# Altium schematic sheet Placa_da_Base.SchDoc: Placa Motores e Sensores
size A3; Author: Eng. Davi Alexandre; CompanyName: Lamotriz; Organization: UFC; Address1: Fortaleza, Ceará - Brasil; Revision: Prof. Dr. Wilckley Bezerra; SheetNumber: 2; SheetTotal: 2; Machine: Lightweight Robot Arm; VersionProject: 2
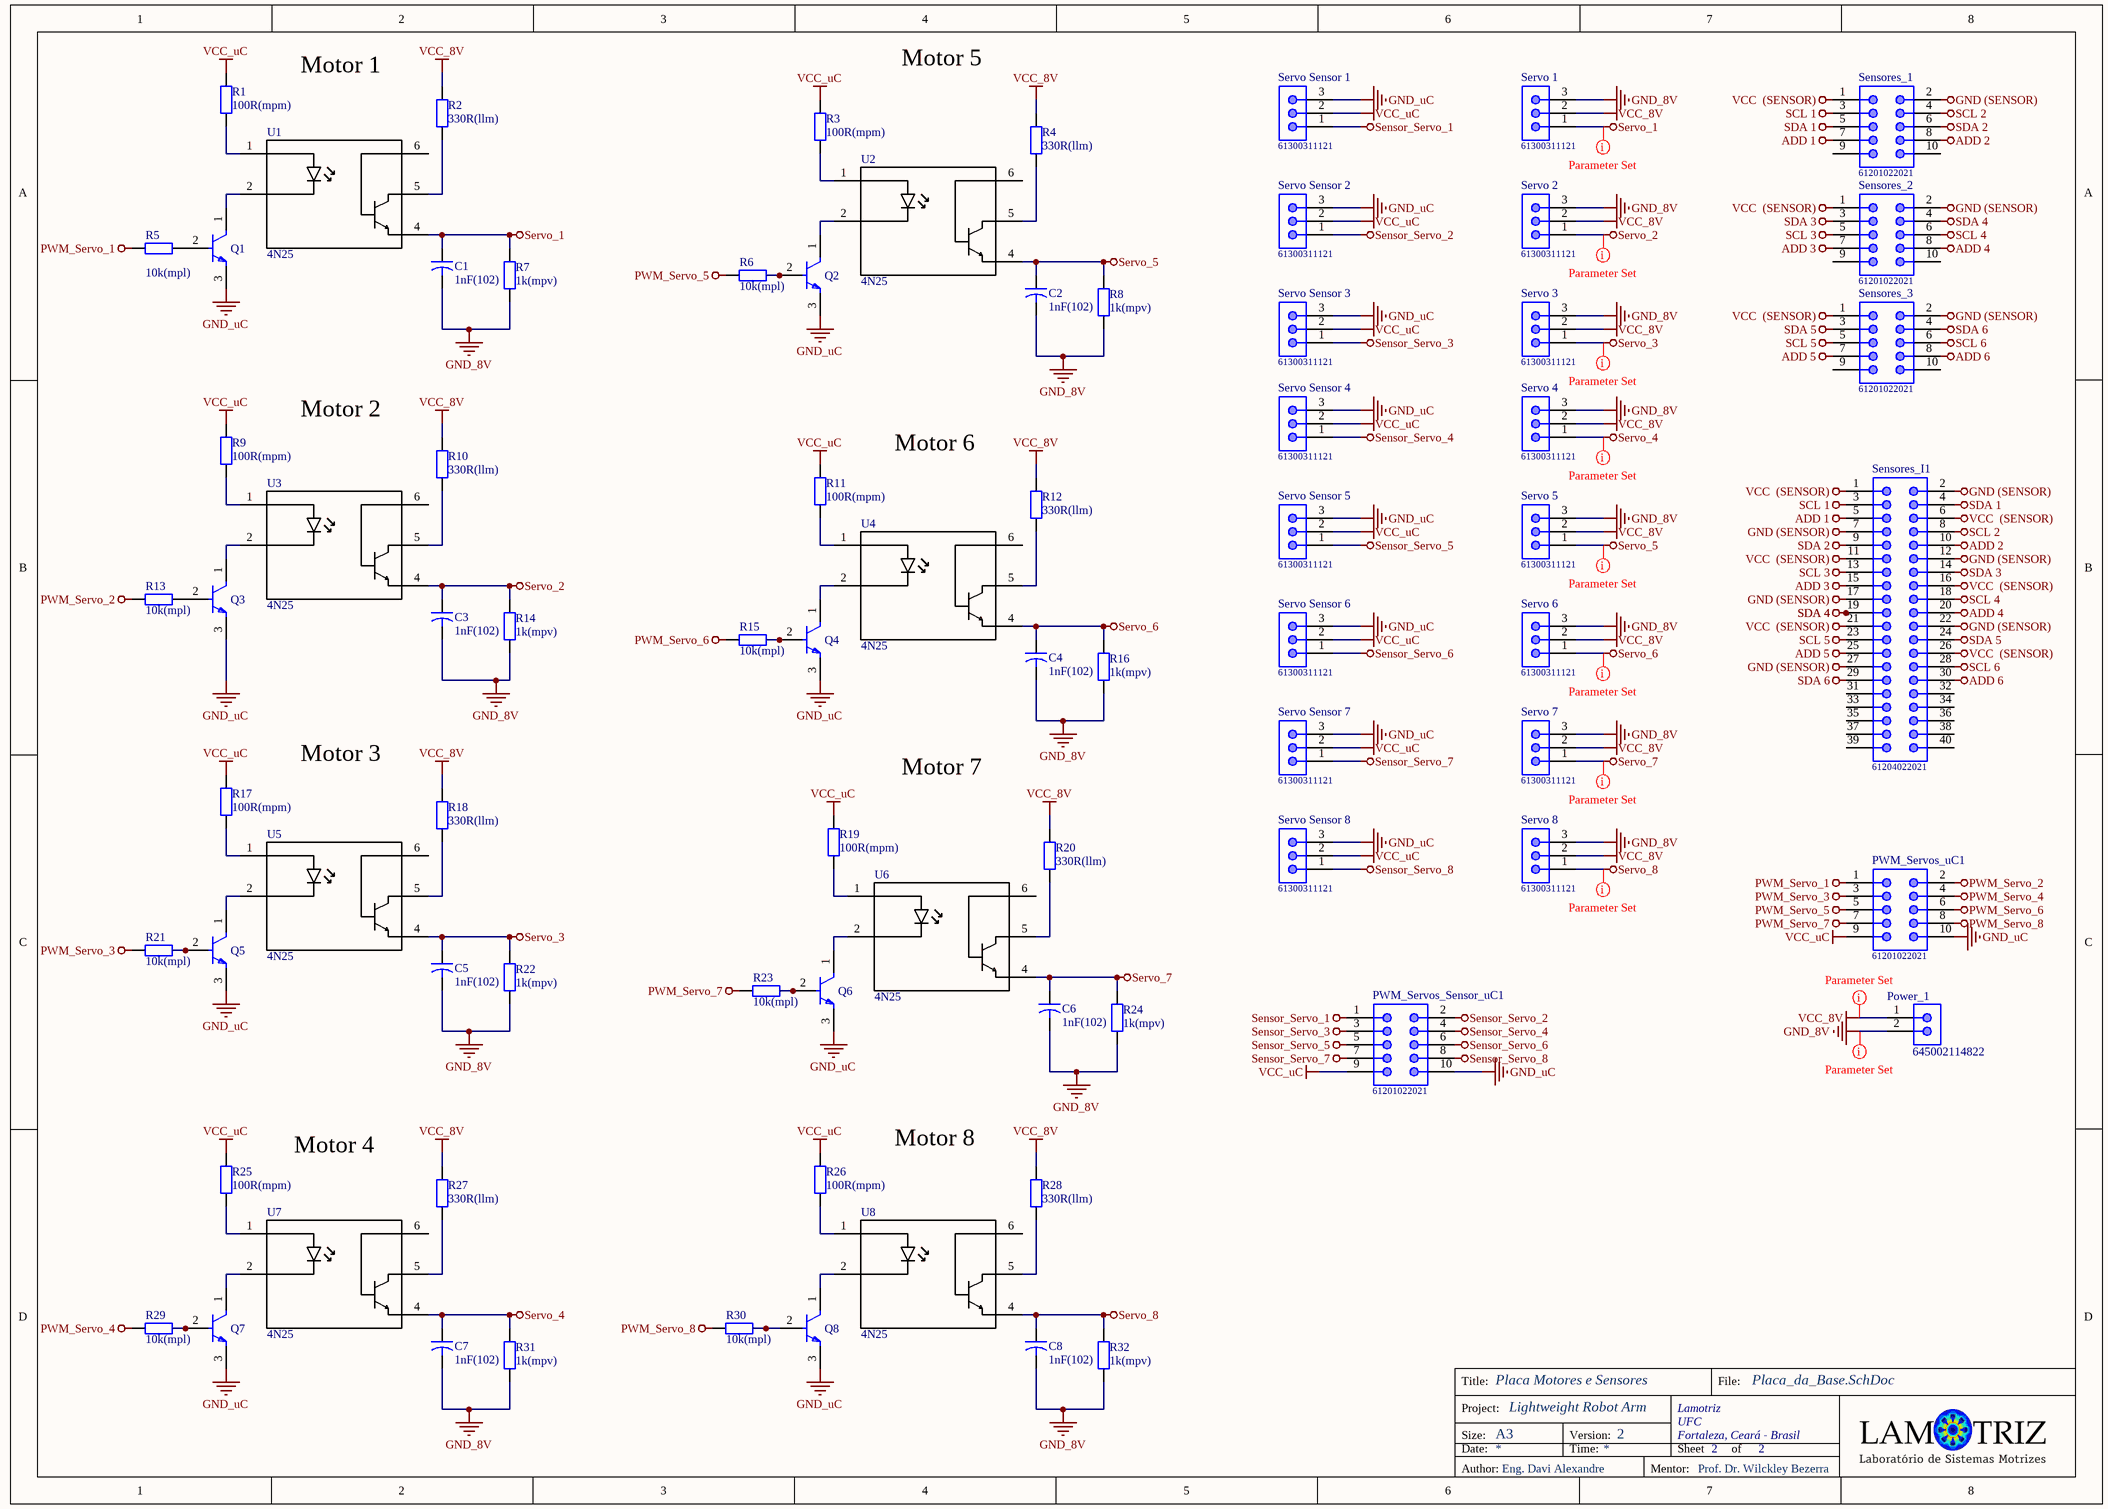
[diagram p0: Placa_da_Base.SchDoc]

## Parts
C1  1nF(102)  [CAPR5-4X5]
C2  1nF(102)  [CAPR5-4X5]
C3  1nF(102)  [CAPR5-4X5]
C4  1nF(102)  [CAPR5-4X5]
C5  1nF(102)  [CAPR5-4X5]
C6  1nF(102)  [CAPR5-4X5]
C7  1nF(102)  [CAPR5-4X5]
C8  1nF(102)  [CAPR5-4X5]
Power_1  645002114822  [645002114822]
PWM_Servos_Sensor_uC1  61201022021  [61201022021]
PWM_Servos_uC1  61201022021  [61201022021]
Q1  Trans_Fairchild_BC547_eec  [Fairchild_BC547_0]  (value not drawn)
Q2  Trans_Fairchild_BC547_eec  [Fairchild_BC547_0]  (value not drawn)
Q3  Trans_Fairchild_BC547_eec  [Fairchild_BC547_0]  (value not drawn)
Q4  Trans_Fairchild_BC547_eec  [Fairchild_BC547_0]  (value not drawn)
Q5  Trans_Fairchild_BC547_eec  [Fairchild_BC547_0]  (value not drawn)
Q6  Trans_Fairchild_BC547_eec  [Fairchild_BC547_0]  (value not drawn)
Q7  Trans_Fairchild_BC547_eec  [Fairchild_BC547_0]  (value not drawn)
Q8  Trans_Fairchild_BC547_eec  [Fairchild_BC547_0]  (value not drawn)
R1  100R(mpm)  [AXIAL-0.4]
R2  330R(llm)  [AXIAL-0.4]
R3  100R(mpm)  [AXIAL-0.4]
R4  330R(llm)  [AXIAL-0.4]
R5  10k(mpl)  [AXIAL-0.4]
R6  10k(mpl)  [AXIAL-0.4]
R7  1k(mpv)  [AXIAL-0.4]
R8  1k(mpv)  [AXIAL-0.4]
R9  100R(mpm)  [AXIAL-0.4]
R10  330R(llm)  [AXIAL-0.4]
R11  100R(mpm)  [AXIAL-0.4]
R12  330R(llm)  [AXIAL-0.4]
R13  10k(mpl)  [AXIAL-0.4]
R14  1k(mpv)  [AXIAL-0.4]
R15  10k(mpl)  [AXIAL-0.4]
R16  1k(mpv)  [AXIAL-0.4]
R17  100R(mpm)  [AXIAL-0.4]
R18  330R(llm)  [AXIAL-0.4]
R19  100R(mpm)  [AXIAL-0.4]
R20  330R(llm)  [AXIAL-0.4]
R21  10k(mpl)  [AXIAL-0.4]
R22  1k(mpv)  [AXIAL-0.4]
R23  10k(mpl)  [AXIAL-0.4]
R24  1k(mpv)  [AXIAL-0.4]
R25  100R(mpm)  [AXIAL-0.4]
R26  100R(mpm)  [AXIAL-0.4]
R27  330R(llm)  [AXIAL-0.4]
R28  330R(llm)  [AXIAL-0.4]
R29  10k(mpl)  [AXIAL-0.4]
R30  10k(mpl)  [AXIAL-0.4]
R31  1k(mpv)  [AXIAL-0.4]
R32  1k(mpv)  [AXIAL-0.4]
Sensores_1  61201022021  [61201022021]
Sensores_2  61201022021  [61201022021]
Sensores_3  61201022021  [61201022021]
Sensores_I1  61204022021  [61204022021]
Servo_1  61300311121  [61300311121]
Servo_2  61300311121  [61300311121]
Servo_3  61300311121  [61300311121]
Servo_4  61300311121  [61300311121]
Servo_5  61300311121  [61300311121]
Servo_6  61300311121  [61300311121]
Servo_7  61300311121  [61300311121]
Servo_8  61300311121  [61300311121]
Servo_Sensor_1  61300311121  [61300311121]
Servo_Sensor_2  61300311121  [61300311121]
Servo_Sensor_3  61300311121  [61300311121]
Servo_Sensor_4  61300311121  [61300311121]
Servo_Sensor_5  61300311121  [61300311121]
Servo_Sensor_6  61300311121  [61300311121]
Servo_Sensor_7  61300311121  [61300311121]
Servo_Sensor_8  61300311121  [61300311121]
U1  4N25  [*DIP762W50P254L712H400Q6N]
U2  4N25  [*DIP762W50P254L712H400Q6N]
U3  4N25  [*DIP762W50P254L712H400Q6N]
U4  4N25  [*DIP762W50P254L712H400Q6N]
U5  4N25  [*DIP762W50P254L712H400Q6N]
U6  4N25  [*DIP762W50P254L712H400Q6N]
U7  4N25  [*DIP762W50P254L712H400Q6N]
U8  4N25  [*DIP762W50P254L712H400Q6N]

## Nets
ADD 1: Sensores_1.7 Sensores_I1.5
ADD 2: Sensores_1.8 Sensores_I1.10
ADD 3: Sensores_2.7 Sensores_I1.15
ADD 4: Sensores_2.8 Sensores_I1.20
ADD 5: Sensores_3.7 Sensores_I1.25
ADD 6: Sensores_3.8 Sensores_I1.30
GND (SENSOR): Sensores_1.2 Sensores_2.2 Sensores_3.2 Sensores_I1.2 Sensores_I1.7 Sensores_I1.12 Sensores_I1.17 Sensores_I1.22 Sensores_I1.27
GND_8V: C1.2 C2.2 C3.2 C4.2 C5.2 C6.2 C7.2 C8.2 Power_1.2 R7.1 R8.1 R14.1 R16.1 R22.1 R24.1 R31.1 R32.1 Servo_1.3 Servo_2.3 Servo_3.3 Servo_4.3 Servo_5.3 Servo_6.3 Servo_7.3 Servo_8.3
GND_uC: PWM_Servos_Sensor_uC1.10 PWM_Servos_uC1.10 Q1.3(E) Q2.3(E) Q3.3(E) Q4.3(E) Q5.3(E) Q6.3(E) Q7.3(E) Q8.3(E) Servo_Sensor_1.3 Servo_Sensor_2.3 Servo_Sensor_3.3 Servo_Sensor_4.3 Servo_Sensor_5.3 Servo_Sensor_6.3 Servo_Sensor_7.3 Servo_Sensor_8.3
PWM_Servo_1: PWM_Servos_uC1.1 R5.2
PWM_Servo_2: PWM_Servos_uC1.2 R13.2
PWM_Servo_3: PWM_Servos_uC1.3 R21.2
PWM_Servo_4: PWM_Servos_uC1.4 R29.2
PWM_Servo_5: PWM_Servos_uC1.5 R6.2
PWM_Servo_6: PWM_Servos_uC1.6 R15.2
PWM_Servo_7: PWM_Servos_uC1.7 R23.2
PWM_Servo_8: PWM_Servos_uC1.8 R30.2
SCL 1: Sensores_1.3 Sensores_I1.3
SCL 2: Sensores_1.4 Sensores_I1.8
SCL 3: Sensores_2.5 Sensores_I1.13
SCL 4: Sensores_2.6 Sensores_I1.18
SCL 5: Sensores_3.5 Sensores_I1.23
SCL 6: Sensores_3.6 Sensores_I1.28
SDA 1: Sensores_1.5 Sensores_I1.4
SDA 2: Sensores_1.6 Sensores_I1.9
SDA 3: Sensores_2.3 Sensores_I1.14
SDA 4: Sensores_2.4 Sensores_I1.19
SDA 5: Sensores_3.3 Sensores_I1.24
SDA 6: Sensores_3.4 Sensores_I1.29
Sensor_Servo_1: PWM_Servos_Sensor_uC1.1 Servo_Sensor_1.1
Sensor_Servo_2: PWM_Servos_Sensor_uC1.2 Servo_Sensor_2.1
Sensor_Servo_3: PWM_Servos_Sensor_uC1.3 Servo_Sensor_3.1
Sensor_Servo_4: PWM_Servos_Sensor_uC1.4 Servo_Sensor_4.1
Sensor_Servo_5: PWM_Servos_Sensor_uC1.5 Servo_Sensor_5.1
Sensor_Servo_6: PWM_Servos_Sensor_uC1.6 Servo_Sensor_6.1
Sensor_Servo_7: PWM_Servos_Sensor_uC1.7 Servo_Sensor_7.1
Sensor_Servo_8: PWM_Servos_Sensor_uC1.8 Servo_Sensor_8.1
Servo_1: C1.1 R7.2 Servo_1.1 U1.4(E)
Servo_2: C3.1 R14.2 Servo_2.1 U3.4(E)
Servo_3: C5.1 R22.2 Servo_3.1 U5.4(E)
Servo_4: C7.1 R31.2 Servo_4.1 U7.4(E)
Servo_5: C2.1 R8.2 Servo_5.1 U2.4(E)
Servo_6: C4.1 R16.2 Servo_6.1 U4.4(E)
Servo_7: C6.1 R24.2 Servo_7.1 U6.4(E)
Servo_8: C8.1 R32.2 Servo_8.1 U8.4(E)
VCC  (SENSOR): Sensores_1.1 Sensores_2.1 Sensores_3.1 Sensores_I1.1 Sensores_I1.6 Sensores_I1.11 Sensores_I1.16 Sensores_I1.21 Sensores_I1.26
VCC_8V: Power_1.1 R2.2 R4.2 R10.2 R12.2 R18.2 R20.2 R27.2 R28.2 Servo_1.2 Servo_2.2 Servo_3.2 Servo_4.2 Servo_5.2 Servo_6.2 Servo_7.2 Servo_8.2
VCC_uC: PWM_Servos_Sensor_uC1.9 PWM_Servos_uC1.9 R1.2 R3.2 R9.2 R11.2 R17.2 R19.2 R25.2 R26.2 Servo_Sensor_1.2 Servo_Sensor_2.2 Servo_Sensor_3.2 Servo_Sensor_4.2 Servo_Sensor_5.2 Servo_Sensor_6.2 Servo_Sensor_7.2 Servo_Sensor_8.2
NetQ1_1: Q1.1(C) U1.2(K)
NetQ1_2: Q1.2(B) R5.1
NetQ2_1: Q2.1(C) U2.2(K)
NetQ2_2: Q2.2(B) R6.1
NetQ3_1: Q3.1(C) U3.2(K)
NetQ3_2: Q3.2(B) R13.1
NetQ4_1: Q4.1(C) U4.2(K)
NetQ4_2: Q4.2(B) R15.1
NetQ5_1: Q5.1(C) U5.2(K)
NetQ5_2: Q5.2(B) R21.1
NetQ6_1: Q6.1(C) U6.2(K)
NetQ6_2: Q6.2(B) R23.1
NetQ7_1: Q7.1(C) U7.2(K)
NetQ7_2: Q7.2(B) R29.1
NetQ8_1: Q8.1(C) U8.2(K)
NetQ8_2: Q8.2(B) R30.1
NetR1_1: R1.1 U1.1(A)
NetR2_1: R2.1 U1.5(C)
NetR3_1: R3.1 U2.1(A)
NetR4_1: R4.1 U2.5(C)
NetR9_1: R9.1 U3.1(A)
NetR10_1: R10.1 U3.5(C)
NetR11_1: R11.1 U4.1(A)
NetR12_1: R12.1 U4.5(C)
NetR17_1: R17.1 U5.1(A)
NetR18_1: R18.1 U5.5(C)
NetR19_1: R19.1 U6.1(A)
NetR20_1: R20.1 U6.5(C)
NetR25_1: R25.1 U7.1(A)
NetR26_1: R26.1 U8.1(A)
NetR27_1: R27.1 U7.5(C)
NetR28_1: R28.1 U8.5(C)

Not connected (* = marked no-connect by the designer): Sensores_1 9 10; Sensores_2 9 10; Sensores_3 9 10; Sensores_I1 31 32 33 34 35 36 37 38 39 40; U1 6(B); U2 6(B); U3 6(B); U4 6(B); U5 6(B); U6 6(B); U7 6(B); U8 6(B)

## Layout directives
rule Width Constraint [Pref Width = 60mil    Min Width = 50mil    Max Width = 60mil]: VCC_8V
rule Width Constraint [Pref Width = 50mil    Min Width = 50mil    Max Width = 50mil]: GND_8V
rule Width Constraint [Pref Width = 30mil    Min Width = 30mil    Max Width = 30mil]: Servo_1, Servo_2, Servo_3, Servo_4, Servo_5, Servo_6, Servo_7, Servo_8

## Notes on the sheet
- Motor 1
- Motor 5
- Motor 2
- Motor 6
- Motor 3
- Motor 7
- Motor 4
- Motor 8
- Title:
- File:
- Project:
- Size:
- Date:
- A3
- Version:
- Time:
- Sheet
- of
- Author:
- Mentor:

## Library data of the parts
C1-C8 = Cap2: Capacitor; Published: 23-Sep-2002; PackageReference: CAPR5-4X5; Publisher: Altium Limited; PackageDescription: Capacitor; 2 Leads
Power_1 = 645002114822: WR-WTB THT Male Vertical Locking Header, pitch 3.96mm, 2p; Pin Number: 2; Contact Resistance: 20mOhm; Rated Current: 7A; Withstanding Voltage: 1500VAC; Working Voltage: 250VAC; ComponentLink1Description: Manufacturer; ComponentLink1URL: http://www.we-online.de; ComponentLink2Description: Datasheet; ComponentLink2URL: https://www.we-online.com/catalog/datasheet/645002114822.pdf; Pitch: 3.96mm; Published Date: January 2020; Publisher: Wurth Elektronik; Mounting Technology: THT; Packaging: Bag; Operating Temperature: -40 to +105degC; Part Number: 645002114822; Gender: Male; Type: Vertical
PWM_Servos_Sensor_uC1 PWM_Servos_uC1 Sensores_1-Sensores_3 = 61201022021: Male Box Header WR-BHD with lever, THT, Vertical, pitch 2.54 mm, 10 pins; Pitch: 2.54 mm; Working Voltage: 250 VAC; Withstanding Voltage: 500 VAC; Contact Resistance: 20 mOhm; Pin Number: 10; ComponentLink1Description: Manufacturer; ComponentLink1URL: http://www.we-online.de; ComponentLink2Description: Datasheet; ComponentLink2URL: https://katalog.we-online.de/em/datasheet/6120xx22021.pdf; Part Number: 61201022021; Published Date: August 2018; Publisher: Wurth Elektronik; Operating Temperature: -40 to 125 degC; Packaging: Tray; Gender: Male; Mounting Technology: THT; Orientation: Vertical
Q1-Q8 = Trans_Fairchild_BC547_eec: TRANS NPN 45V 0.1A TO-92; Part Number: BC547; Power: 500mW; helpURL: https://upverter.com/upn/revision/b6c8bf2a31a37ee3/; ComponentLink2Description: Datasheet; Temperature: -65°C to +150°C; Package: TO-92; Supplier 2: Mouser; Supplier 1: Digi-Key; ComponentLink1URL: https://upverter.com/upn/revision/b6c8bf2a31a37ee3/; Supplier Part Number 2: 512-BC547; Supplier Part Number 1: BC547-ND; Manufacturer: Fairchild; ComponentLink1Description: Upverter; ComponentLink2URL: https://upverter.com/datasheet/00a4bcea94b7f6a06c7169869aec7b7ac700d7c3.pdf; RoHS: TRUE; Mouser Part Number: 512-BC547; Ipc Land Pattern Name: TO-92; Temperature Range High: +150°C; Digikey Description: TRANS NPN 45V 0.1A TO-92; Digikey Part Number: BC547-ND; Lead Free: yes; Temperature Range Low: -65°C
R1 R3-R32 = Res2: Resistor; Published: 8-Jun-2000; LatestRevisionDate: 17-Jul-2002; LatestRevisionNote: Re-released for DXP Platform.; PackageReference: AXIAL-0.4; Publisher: Altium Limited; PackageDescription: Axial Device, Thru-Hole; 2 Leads; 0.4 in Pin Spacing
  R1: Value: 100R(mpm)
  R5: Value: 10k(mpl)
R2 = Res2: Resistor; Value: 10K (mpl); Published: 8-Jun-2000; LatestRevisionDate: 17-Jul-2002; LatestRevisionNote: Re-released for DXP Platform.; PackageReference: AXIAL-0.4; Publisher: Altium Limited; PackageDescription: Axial Device, Thru-Hole; 2 Leads; 0.4 in Pin Spacing
Sensores_I1 = 61204022021: Male Box Header WR-BHD with lever, THT, Vertical, pitch 2.54 mm, 40 pins; Pitch: 2.54 mm; Working Voltage: 250 VAC; Withstanding Voltage: 500 VAC; Contact Resistance: 20 mOhm; Pin Number: 40; ComponentLink1Description: Manufacturer; ComponentLink1URL: http://www.we-online.de; ComponentLink2Description: Datasheet; ComponentLink2URL: https://katalog.we-online.de/em/datasheet/6120xx22021.pdf; Part Number: 61204022021; Published Date: August 2018; Publisher: Wurth Elektronik; Operating Temperature: -40 to 125 degC; Packaging: Tray; Gender: Male; Mounting Technology: THT; Orientation: Vertical
Servo_1-Servo_8 Servo_Sensor_1-Servo_Sensor_8 = 61300311121: WR-PHD Pin Header, THT, pitch 2.54mm, Single Row, Vertical, 3pin; Pin Number: 3; Gender: Male; Rated Current: 3A; Working Voltage: 250VAC; Withstanding Voltage: 500VAC; Contact Resistance: 20mOhm; ComponentLink1Description: Manufacturer; ComponentLink1URL: http://www.we-online.de; ComponentLink2Description: Datasheet; ComponentLink2URL: https://katalog.we-online.de/em/datasheet/6130xx11121.pdf; Part Number: 61300311121; Published Date: June 2019; Publisher: Wurth Elektronik; Pitch: 2.54mm; Operating Temperature: -40 to +105degC; Mounting Technology: THT; Packaging: Bag; Row Number: Single; Orientation: Vertical
U1-U8 = 4N25: Optoisolator Transistor with Base Output 5000Vrms 1 Channel 6-DIP; MF: Vishay Semiconductor; Digi-Key_Purchase_URL: https://www.digikey.com/product-detail/en/vishay-semiconductor-opto-division/4N25/4N25VS-ND/1738516?utm_source=snapeda&utm_medium=aggregator&utm_campaign=symbol; Digi-Key_Part_Number: 4N25VS-ND; Package: DIP-6 Lite-On; SnapEDA_Link: https://www.snapeda.com/parts/4N25/Vishay%20Semiconductor%20Opto%20Division/view-part/641454/?ref=snap; MP: 4N25; Value: *